# EAGLE design RGB_Light (EAGLE 7.5.0)
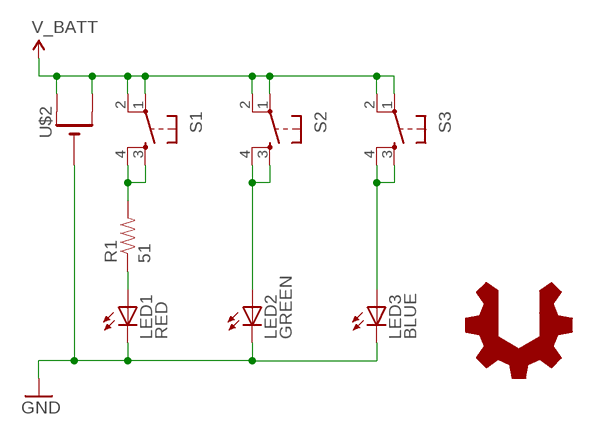
[diagram p0: schematic, sheet 1]

## Parts
LED1  RED  LEDOVAL  [LED-OVAL]
LED2  GREEN  LEDOVAL  [LED-OVAL]
LED3  BLUE  LEDOVAL  [LED-OVAL]
R1  51  RESISTORAXIAL-0.3  [AXIAL-0.3]
S1  TAC_SWITCHPTH  [TACTILE-PTH]
S2  TAC_SWITCHPTH  [TACTILE-PTH]
S3  TAC_SWITCHPTH  [TACTILE-PTH]
U$1  USER_HACKABLE  [USER_HACKABLE]
U$2  CR2032THM  [CR2032-THRU]

## Nets
GND: LED1.CATHODE(C) LED2.CATHODE(C) LED3.CATHODE(C) U$2.-
N$1: LED2.ANODE(A) S2.3 S2.4
N$2: R1.P$2 S1.3 S1.4
N$3: LED3.ANODE(A) S3.3 S3.4
N$4: LED1.ANODE(A) R1.P$1
V_BATT: S1.1 S1.2 S2.1 S2.2 S3.1 S3.2 U$2.+1(+) U$2.+2(+1)

## Library data of the parts
LED1-LED3 = barbary_enterprises:LED: LEDs Standard schematic elements and footprints for 5mm, 3mm, 1206, and 0603 sized LEDs. 5mm - Spark Fun Electronics SKU : COM-00529 (and others)
R1 = barbary_enterprises:RESISTOR: Resistor Basic schematic elements and footprints for 0603, 1206, and PTH resistors.
S1-S3 = barbary_enterprises:TAC_SWITCH: Momentary Switch Button commonly used for reset or general input. Spark Fun Electronics SKU : COM-00097 SMT- SWCH-08247
U$1 = logo:USER_HACKABLE
U$2 = battery:CR2032

## Board
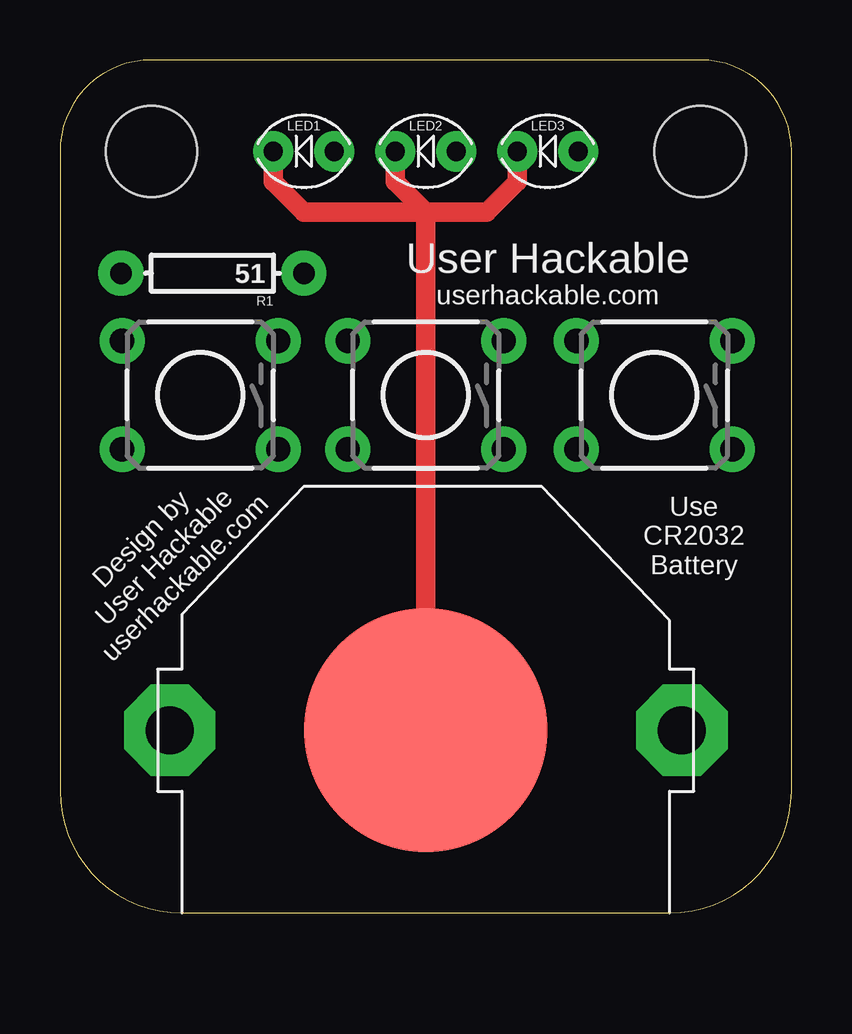
[diagram p1: board, top side]
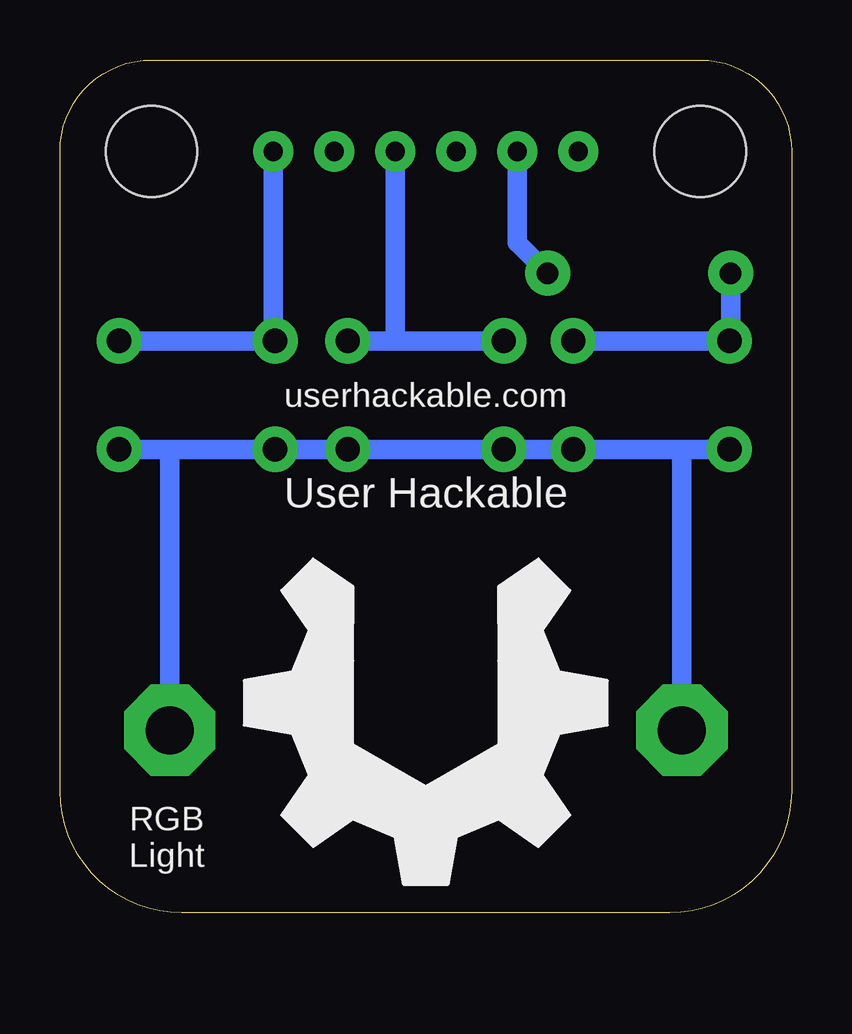
[diagram p2: board, bottom side, seen from below]

Size 30.48 x 35.56 mm. Coordinates in mm from the lower left corner, seen from the top.
Outline: 0,31.75 0,5.08 arc90 5.08,0 25.4,0 arc90 30.48,5.08 30.48,31.75 arc90 26.67,35.56 3.81,35.56 arc90 0,31.75
Copper layers (1*16): Top 0.0356mm / dielectric 1.5011mm / Bottom 0.0356mm
Design rules "LaenPCBOrder": minimum track width 6mil, minimum drill 13mil, track to track 6mil, track to pad 6mil, pad to pad 6mil, via to via 6mil, smd to smd 6mil, copper to edge 15mil, drill to drill 6mil, minimum pad ring 7mil, minimum via ring 7mil, stop-mask expansion 3mil, vias tented up to drill 0mil, thermal gap 10mil
Holes 3.81 mm at 26.67,31.75 3.81,31.75

### Footprints (pad centres in the part's own frame; a part is rotated, then mirrored left to right if it is on the bottom)
LED-OVAL = drill 0.8 pad 1.676: ANODE 1.27,0; CATHODE -1.27,0
AXIAL-0.3 = drill 0.9 pad 1.88: P$1 -3.81,0; P$2 3.81,0
TACTILE-PTH = drill 1.016 pad 1.88: 1 -3.251,2.261; 2 3.251,2.261; 3 -3.251,-2.261; 4 3.251,-2.261
CR2032-THRU = drill 2 pad 3.81 octagon: +1 -10.668,0; +2 10.668,0 | smd 10.16 x 10.16: - 0,0

### Placement (x,y rotation side)
LED1  10.16,31.75 0 top
LED2  15.24,31.75 0 top
LED3  20.32,31.75 0 top
R1  6.35,26.67 180 top
S1  5.84,21.59 180 top
S2  15.24,21.59 180 top
S3  24.77,21.59 180 top
U$1  15.24,8.76 0 bottom
U$2  15.24,7.62 180 top

### Tracks (layer width: path | path; a pad name or v marks a point on that pad's centre or on a via)
GND
  Top 0.813: U$2.- 15.24,29.21 | 15.24,29.21 13.97,30.48 LED2.CATHODE | LED1.CATHODE 8.89,30.48 10.16,29.21 15.24,29.21 | LED3.CATHODE 19.05,30.48 17.78,29.21 15.24,29.21
N$1
  Bottom 0.813: S2.4 16.51,23.85 | 16.51,23.85 S2.3 | LED2.ANODE 16.51,23.85
N$2
  Bottom 0.813: S1.3 S1.4 2.54,23.9 R1.P$2
N$3
  Bottom 0.813: S3.3 S3.4 21.59,23.93 LED3.ANODE
N$4
  Bottom 0.813: LED1.ANODE 11.43,27.94 R1.P$1
V_BATT
  Bottom 0.813: S1.2 4.57,19.33 | 4.57,19.33 S1.1 S2.2 S2.1 S3.2 25.91,19.33 | S3.1 25.91,19.33 | U$2.+2 4.57,19.33 | U$2.+1 25.91,19.33

### Text on the board
tPlace: User Hackable | userhackable.com | Use / CR2032 / Battery | Design by / User Hackable / userhackable.com
bPlace: userhackable.com | User Hackable | RGB / Light